# Altium schematic sheet supply0.SchDoc: foxBMS BMS-Master
size A3; DocumentNumber: 2; SheetNumber: 2; SheetTotal: 24; Author: Fraunhofer IISB foxBMS Team; REL-DATE: 2017-05-16; VERSION: 1.0.2; SheetDescription: Supply for MCU0 and peripherals
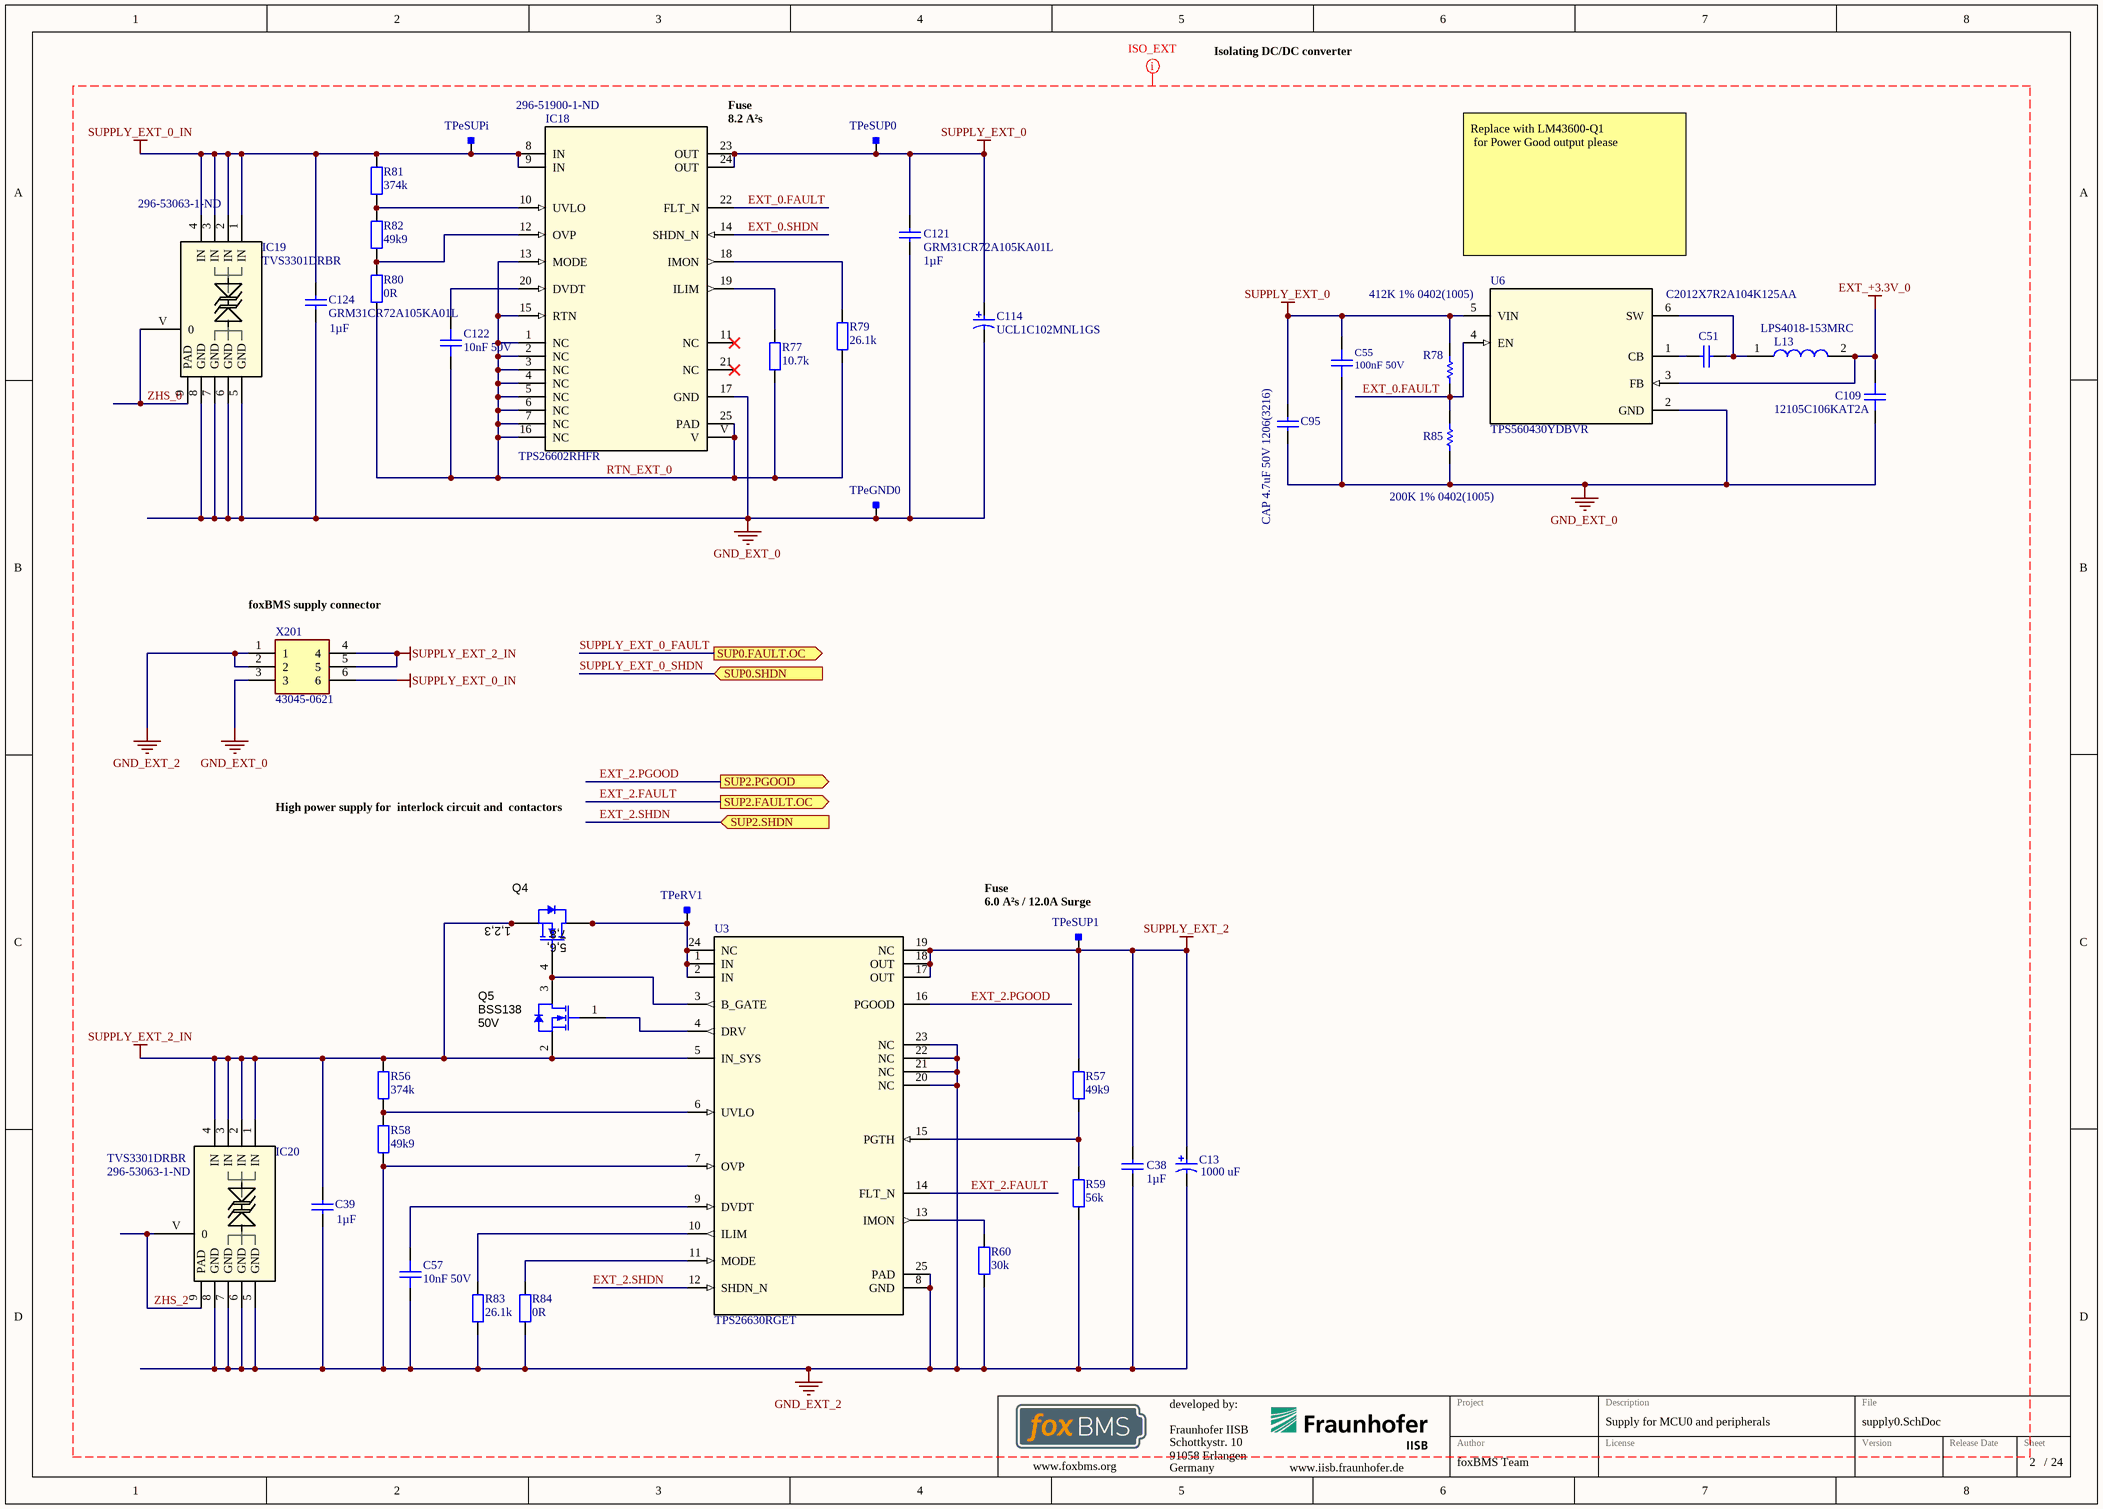
[diagram p0: supply0.SchDoc]

## Parts
C13  Rated Capacitance: 1000 uF  [NIC-UCL-10x13.5-2_V]  (hidden comment: UCL1C102MNL1GS)
C38  Capacitance: 1µF  [CAPC3216X180X55ML20T25]  (hidden comment: GRM31CR72A105KA01L)
C39  Capacitance: 1µF  [CAPC3216X180X55ML20T25]  (hidden comment: GRM31CR72A105KA01L)
C51  C2012X7R2A104K125AA  [CAPC2013X145X20ML20]
C55  100nF 50V  [0603C]
C57  10nF 50V  [0402C]
C95  CAP 4.7uF 50V 1206(3216)  [CAPC1206(3216)190_N]
C109  12105C106KAT2A  [CAPC3225X279X50LL20T25]
C114  UCL1C102MNL1GS  [NIC-UCL-10x13.5-2_V]
C121  GRM31CR72A105KA01L  Capacitance: 1µF  [CAPC3216X180X55ML20T25]
C122  10nF 50V  [0402C]
C124  GRM31CR72A105KA01L  Capacitance: 1µF  [CAPC3216X180X55ML20T25]
IC18  TPS26602RHFR  Supplier Part Number 1: 296-51900-1-ND  [RHF0024A]
IC19  TVS3301DRBR  Supplier Part Number 1: 296-53063-1-ND  [DRB0008F]
IC20  TVS3301DRBR  Supplier Part Number 1: 296-53063-1-ND  [DRB0008F]
L13  LPS4018-153MRC  [LPS4018223MRC]
Q4  CSD17308Q3  [TRANS_NexFET_Q3]  (value not drawn)
Q5  BSS138  value 50V  [SOT-23]
R56  374k  [0402R]
R57  49k9  [0402R]
R58  49k9  [0402R]
R59  56k  [0402R]
R60  30k  [0402R]
R77  10.7k  [0402R]
R78  412K 1% 0402(1005)  [RESC0402(1005)_L]
R79  26.1k  [0402R]
R80  0R  [0402R]
R81  374k  [0402R]
R82  49k9  [0402R]
R83  26.1k  [0402R]
R84  0R  [0402R]
R85  200K 1% 0402(1005)  [RESC0402(1005)_L]
TPeGND0  Testpoint_Square  [Testpoint_S1]  (value not drawn)  (no BOM)
TPeRV1  Testpoint_Square  [Testpoint_S1]  (value not drawn)  (no BOM)
TPeSUP0  Testpoint_Square  [Testpoint_S1]  (value not drawn)  (no BOM)
TPeSUP1  Testpoint_Square  [Testpoint_S1]  (value not drawn)  (no BOM)
TPeSUPi  Testpoint_Square  [Testpoint_S1]  (value not drawn)  (no BOM)
U3  TPS26630RGET  [RGE0024H]
U6  TPS560430YDBVR  [DBV0006A_N]
X201  43045-0621  [43045-0621]

## Ports
SUP0.FAULT.OC (out), SUP0.SHDN (in), SUP2.FAULT.OC (out), SUP2.PGOOD (out), SUP2.SHDN (in)

## Nets
EXT_+3.3V_0: C109.2 L13.2 U6.3(FB)
GND_EXT_0: C55.1 C95.1 C109.1 C114.2 C121.1 C124.1 IC18.17(GND) IC19.5(GND) IC19.6(GND) IC19.7(GND) IC19.8(GND) R85.1 TPeGND0.1 U6.2(GND) X201.3
GND_EXT_2: C13.2 C38.1 C39.1 C57.2 IC20.5(GND) IC20.6(GND) IC20.7(GND) IC20.8(GND) R58.1 R59.1 R60.1 R83.1 R84.1 U3.7(OVP) U3.8(GND) U3.20(NC) U3.21(NC) U3.22(NC) U3.23(NC) U3.25(PAD) X201.1 X201.2
SUPPLY_EXT_0: C55.2 C95.2 C114.1 C121.2 IC18.23(OUT) IC18.24(OUT) R78.2 TPeSUP0.1 U6.5(VIN)
SUPPLY_EXT_0_IN: C124.2 IC18.8(IN) IC18.9(IN) IC19.1(IN) IC19.2(IN) IC19.3(IN) IC19.4(IN) R81.2 TPeSUPi.1 X201.6
SUPPLY_EXT_2: C13.1 C38.2 R57.2 TPeSUP1.1 U3.17(OUT) U3.18(OUT) U3.19(NC)
SUPPLY_EXT_2_IN: C39.2 IC20.1(IN) IC20.2(IN) IC20.3(IN) IC20.4(IN) Q4.1(S) Q4.2(S) Q4.3(S) Q5.2(S) R56.2 U3.5(IN_SYS) X201.4 X201.5
EXT_0.FAULT: IC18.22(FLT_N) R78.1 R85.2 U6.4(EN)
EXT_0.SHDN: IC18.14(SHDN_N)
EXT_2.FAULT: U3.14(FLT_N) ; port SUP2.FAULT.OC
EXT_2.PGOOD: U3.16(PGOOD) ; port SUP2.PGOOD
EXT_2.SHDN: U3.12(SHDN_N) ; port SUP2.SHDN
RTN_EXT_0: C122.2 IC18.1(NC) IC18.2(NC) IC18.3(NC) IC18.4(NC) IC18.5(NC) IC18.6(NC) IC18.7(NC) IC18.13(MODE) IC18.15(RTN) IC18.16(NC) IC18.25(PAD) IC18.V R77.1 R79.1 R80.1
SUPPLY_EXT_0_FAULT: port SUP0.FAULT.OC
SUPPLY_EXT_0_SHDN: port SUP0.SHDN
ZHS_0: IC19.9(PAD) IC19.V(0)
ZHS_2: IC20.9(PAD) IC20.V(0)
NetC51_1: C51.1 U6.1(CB)
NetC51_2: C51.2 L13.1 U6.6(SW)
NetC57_1: C57.1 U3.9(DVDT)
NetC122_1: C122.1 IC18.20(DVDT)
NetIC18_10: IC18.10(UVLO) R81.1 R82.2
NetIC18_12: IC18.12(OVP) R80.2 R82.1
NetIC18_18: IC18.18(IMON) R79.2
NetIC18_19: IC18.19(ILIM) R77.2
NetQ4_4: Q4.4(G) Q5.3(D) U3.3(B_GATE)
NetQ4_5: Q4.5(D) Q4.6(D) Q4.7(D) Q4.8(D) TPeRV1.1 U3.1(IN) U3.2(IN) U3.24(NC)
NetQ5_1: Q5.1(G) U3.4(DRV)
NetR56_1: R56.1 R58.2 U3.6(UVLO)
NetR57_1: R57.1 R59.2 U3.15(PGTH)
NetR60_2: R60.2 U3.13(IMON)
NetR83_2: R83.2 U3.10(ILIM)
NetR84_2: R84.2 U3.11(MODE)

Not connected (* = marked no-connect by the designer): IC18 11(NC)* 21(NC)*

## Layout directives
net class ISO_EXT: EXT_0.FAULT, EXT_0.SHDN, EXT_2.FAULT, EXT_2.PGOOD, EXT_2.SHDN, EXT_+3.3V_0, GND_EXT_0, GND_EXT_2, RTN_EXT_0, SUPPLY_EXT_0, SUPPLY_EXT_0_FAULT, SUPPLY_EXT_0_IN, SUPPLY_EXT_0_SHDN, SUPPLY_EXT_2, SUPPLY_EXT_2_IN, ZHS_0, ZHS_2

## Notes on the sheet
- (near IC18) Fuse
- Isolating DC/DC converter
- (near IC18) 8.2 A²s
- Replace with LM43600-Q1
  for Power Good output please
- (near X201) foxBMS supply connector
- High power supply for
  interlock circuit and
  contactors
- Fuse
- (near TPeSUP1) 6.0 A²s / 12.0A Surge
- Fraunhofer IISB
- Schottkystr. 10
- developed by:
- 91058 Erlangen
- Germany
- Author
- Project
- License
- Description
- File
- Version
- Release Date
- Sheet
- www.foxbms.org
- www.iisb.fraunhofer.de
- foxBMS Team
- /
- (in symbol CSD17308Q3) 1,2,3; 7,8; 5,6,

## Library data of the parts
C13 = CMP-0926-00001-1: Aluminum Electrolytic Capacitor, Low Impedance, 1000 uF +/- 20%, 16 V, -55 to 105 degC, 2-Pin 10.3 x 10.3 x 13.5 mm SMD, RoHS, Reel; Manufacturer: Nichicon; Rated Voltage: 16 V; Capacitance Tolerance: +/- 20%; Polarity Type: Polar; Impedance: 0.06 ohm; Leakage Current: 160 uA; Rated Ripple Current (at 100 kHz): 1190 mA; Capacitance: 1000uF; PackageReference: UCL-10x13.5-2; Mounting Technology: Surface Mount; PackageDescription: 2-Pin SMD, Body 10.3 x 10.3 mm, Height 14.3 mm; ComponentLink1Description: Manufacturer URL; ComponentLink2Description: Datasheet; RoHS: TRUE; DatasheetVersion: Sep-13; PartNumber: UCL1C102MNL1GS; ComponentLink2URL: http://nichicon-us.com/english/products/pdfs/e-cl.pdf; ComponentLink1URL: www.nichicon.com; Packing: Reel; Category Temperature Range: -55 to 105 degC; Part Number: UCL1C102MNL1GS
C38 C39 C121 C124 = gen_C_ceramic_1u_100V_X7R_1206: Chip Capacitor, 1 uF, +/- 10%, 100 V, -55 to 125 degC, 1206 (3216 Metric), RoHS, Tape and Reel; Manufacturer: Murata; Catalog Drawings: GRMSeries_1206_1.6; Featured Product: GA3SafetyRecognizedCapsandHi-CapMLCC; Online Catalog: GRMSeries; Temperature Coefficient: X7R; Product Training Modules: High-CapMultilayerCeramicCapacitors; Other Names: 490-3909-6; Voltage - Rated: 100V; Case EIA: 1206; PnP Package: C_1206_10; PnP Value: 1.0µF/100V/X7R; Height - Seated (Max): -; Features: -; Applications: GeneralPurpose; Manufacturer URL: http://www.murata.com/; Standard Package: 1; Package Reference: 1206; Series: GRM; Package / Case: 1206(3216Metric); Datasheet Version: Sep-11; Ratings: -; Category: Capacitors; Datasheet URL: https://datasheet.ciiva.com/29199/454987-da-01-en-vs-kondensator-1206-29199435.pdf; Operating Temperature: -55degC~125degC; Lead Spacing: -; Family: CeramicCapacitors; Tolerance: ±10%; Packaging: Digi-Reel; Mounting Type: SurfaceMount,MLCC; Package Description: 2-Pin Surface Mount Device, Body 3.2 x 1.6 mm; Lead Style: -; Thickness (Max): 0.071"(1.80mm); Size / Dimension: 0.126"Lx0.063"W(3.20mmx1.60mm); Dielectric: X7R; Rated Voltage: 100V
C51 = CMP-2000-05453-1: Chip Capacitor, 100 nF, +/- 10%, 100 V, -55 to 1255 degC, 0805 (2012 Metric), RoHS, Tape and Reel; Manufacturer: TDK; PCN Part Number: MLCCPartNumberChange30/Nov/2012; Temperature Coefficient: X7R; Voltage - Rated: 100V; Kits: SAMPLEKIT1008-ND-KITCAPCERMLCC100V-630V; Other Names: 445-1418-1; Online Catalog: CSeries,MidVoltage; Featured Product: C-SeriesMidVoltageMLCCs; Catalog Drawings: CSERIES_2012-0805_1.45; Product Training Modules: HighCapacitanceReplacementSEAT,CCV,andTVCLDesignToolsGuidetoReplacinganElectrolyticCapacitorwithanMLCC; Capacitance: 0.1µF; Applications: GeneralPurpose; Datasheet Version: Jul-13; Mounting Type: SurfaceMount,MLCC; Height - Seated (Max): -; Packaging: CutTape(CT); Datasheet URL: https://datasheet.ciiva.com/11788/0900766b80fc5cba-11788142.pdf; Tolerance: ±10%; Package Reference: 805; Manufacturer URL: http://www.tdk.com/; Series: C; Lead Style: -; Operating Temperature: -55degC~125degC; Category: Capacitors; Package Description: 2-Pin Surface Mount Device, Body 2 x 1.25 mm; Standard Package: 1; Package / Case: 0805(2012Metric); Family: CeramicCapacitors; RoHS Information: RoHSCertificate-MLCC; Lead Spacing: -; Ratings: -; Features: -
C55 = gen_C_ceramic_100n_50V_X7R_0603: Ceramic, 100nF, ±10%, 50V, X7R, –55 to 125°C, 0603 (1608),RoHS, Automotive; Part Number: GCJ188R71H104KA12; Manufacturer: Murata; Capacitance: 100n; Case EIA: 0603; Case Metric: 1608; Automotive Qualified: True; PnP Package: C_0603_10; PnP Value: 100nF/50V/X7R; Dielectric: X7R; Rated Voltage: 50V; Height - Seated (Max): 0.8mm; Mounting Type: SurfaceMount,MLCC; Operating Temperature: –55 to 125°C; Series: GCJ; Tolerance: ±10%; Manufacturer_Part_Number: GCJ188R71H104KA12; Supplier 1: Digi-Key; Supplier Part Number 1: 490-5798-1-ND
C57 C122 = gen_C_ceramic_10n_50V_X7R_0402: Ceramic, 10nF, ±10%, 50V, X7R, –55 to 125°C, 0402 (1005),RoHS, Automotive; Part Number: GRT155R71H104KE01; Automotive Qualified: True; Capacitance: 10n; Case EIA: 0402; Case Metric: 1005; PnP Package: C_0402_10; PnP Value: 10n/50V/X7R; Dielectric: X7R; Rated Voltage: 50V
C95 = CMP-1037-04923-1: CAP 4.7uF 50V ±10% 1206 (3216 Metric) Thickness 1.9mm SMD; Case-EIA: 1206; Case-Metric: 3216; Tolerance: Â±10%; Technology: SMT; Rated Voltage: 50 V; Max Thickness: 1.9 mm; Value: 4.7uF
C109 = gen_C_ceramic_10u_50V_X7R_1210: Ceramic, 10uF, 50 V, -55 to 125 degC, 2-Pin SMD (1210), RoHS, Tape and Reel; Manufacturer: AVX; Manufacturer 1: Kyocera AVX; Dielectric: X7R; Tolerance: ±10%; Load Life: 1000h; Type: CommercialSurfaceMountChip; Voltage Rating: 50V; Temperature Coefficient / Code: +/-15%; Case EIA: 1210; Case Metric: 3225; PnP Package: C_1210_10; PnP Value: 10µF/25V/X7R; Rated Voltage: 25V; Maximum Operating Temperature: +125C; Mounting Technology: SurfaceMount; Case Code - in: 1210; Package Description: 2-Pin Surface Mount Device, Body 3.2 x 2.5 mm; Datasheet URL: http://www.farnell.com/datasheets/1818074.pdf; Case Code - mm: 3225; Package / Case: 1210(3225metric); Product: GeneralTypeMLCCs; Capacitance: 10uF; Product Category: MultilayerCeramicCapacitorsMLCC-SMD/SMT; Minimum Operating Temperature: -55C; Manufacturer URL: http://www.avx.com/; Operating Temperature Range: -55Cto+125C; Termination Style: SMD/SMT; Factory Pack Quantity: 1000; RoHS: Details; Brand: AVX; Datasheet Version: 03/2014; Package Reference: 1210; Packaging: Reel; Voltage Rating DC: 50V; Height - Seated (Max): 2.5mm; Mounting Type: SurfaceMount,MLCC; Operating Temperature: –55 to 125°C; Series: GCM; Manufacturer Part Number 1: 12105C106KAT2A
C114 = CMP-0926-00001-1: Aluminum Electrolytic Capacitor, Low Impedance, 1000 uF +/- 20%, 16 V, -55 to 105 degC, 2-Pin 10.3 x 10.3 x 13.5 mm SMD, RoHS, Reel; Manufacturer: Nichicon; Rated Voltage: 16 V; Capacitance Tolerance: +/- 20%; Rated Capacitance: 1000 uF; Polarity Type: Polar; Impedance: 0.06 ohm; Leakage Current: 160 uA; Rated Ripple Current (at 100 kHz): 1190 mA; Capacitance: 1000uF; PackageReference: UCL-10x13.5-2; Mounting Technology: Surface Mount; PackageDescription: 2-Pin SMD, Body 10.3 x 10.3 mm, Height 14.3 mm; ComponentLink1Description: Manufacturer URL; ComponentLink2Description: Datasheet; RoHS: TRUE; DatasheetVersion: Sep-13; PartNumber: UCL1C102MNL1GS; ComponentLink2URL: http://nichicon-us.com/english/products/pdfs/e-cl.pdf; ComponentLink1URL: www.nichicon.com; Packing: Reel; Category Temperature Range: -55 to 105 degC; Part Number: UCL1C102MNL1GS
IC18 = TPS26602RHFR: 37V Clamped input protection; Manufacturer: Texas Instruments; PartNumber: TPS26602RHFR; RefDes: RefDes; TYPE: TYPE; Value: Value; Part Number: TPS26602RHFR; Supplier 1: Digi-Key
IC19 IC20 = TVS3301DRVR: TVS3301 33-V Bidirectional Flat-Clamp Surge Protection Device; Manufacturer: Texas Instruments; Part Number: TVS3301DRBR; RefDes: RefDes; TYPE: TYPE; Value: Value; Supplier 1: Digi-Key
L13 = LPS4018-223MRC: Inductor 15uH; Manufacturer_Name: COILCRAFT; Datasheet Link: https://www.coilcraft.com/pdfs/lps4018.pdf; Height: 1.8mm; Manufacturer_Part_Number: LPS4018-223MRC; Mouser Part Number: 994-LPS4018-223MRC; Mouser Price/Stock: https://www.mouser.com/Search/Refine.aspx?Keyword=994-LPS4018-223MRC
Q4 = CSD17308Q3: MOSFET, N-CH, 30V, 47A, SON 3.3x3.3mm; Manufacturer: Texas Instruments; Alternate Manufacturer: None; U/M: EA; ChType: N; VdsMax_V: 30; Value1: 0.0094 ohm; Rdson45_Ohm: 0.0094; Value2: 3.9 nC; QgTyp_nC: 3.9; Vgs_V: 10; IdsMax_A: 47; SymbolVersion: 2008-07-09; CompType: MOSFET; Value: 30V; PartNumber: CSD17308Q3; PackageReference: SON 3.3x3.3mm; RoHS: Y; MountType: SMT; Published: 2008-06-19; Publisher: Texas Instruments; LatestRevisionDate: 2013-07-24; LatestRevisionNote: Added parts.; ComponentLink1Description: Datasheet link; ComponentLink1URL: http://www.ti.com/lit/ds/symlink/csd17308q3.pdf; Supplier 1: Digi-Key; Supplier Part Number 1: 296-27210-1-ND; Supplier 2: Mouser; Supplier Part Number 2: 595-CSD17308Q3; Supplier 3: Farnell; Supplier Part Number 3: 1892457
Q5 = BSS138: MOSFET, N-CH, 50V, 0.22A, SOT-23; Manufacturer: Fairchild Semiconductor; Alternate Manufacturer: None; U/M: EA; ChType: N; VdsMax_V: 50; Value1: 6 ohm; Rdson45_Ohm: 6; Value2: 1.7 nC; QgTyp_nC: 1.7; Vgs_V: 20; IdsMax_A: 0.22; ComponentLink1URL: http://www.fairchildsemi.com/ds/BS/BSS138.pdf; SymbolVersion: 2008-07-28; PackageReference: SOT-23; PartNumber: BSS138; ComponentLink1Description: Datasheet link; CompType: MOSFET; RoHS: Y; MountType: SMT; Published: 2008-06-19; Publisher: Texas Instruments; LatestRevisionDate: 2013-07-10; LatestRevisionNote: Added parts.; Supplier 1: Digi-Key; Supplier Part Number 1: BSS138CT-ND; Supplier 2: Mouser; Supplier Part Number 2: 512-BSS138; Supplier 3: Farnell; Supplier Part Number 3: 9845330
R56 R81 = gen_R_374k_0402: SMD Resistor 374k 0402; Case EIA: 0402; Case Metric: 1005; PnP Package: R_0402; Automotive Qualified: False; PnP Value: 374k; Operating Temperature: -55°C - +155°C; Part Number: gen_R_374k_0402
R57 R58 R82 = gen_R_49k9_0402: SMD Resistor 49.9k 0402; Case EIA: 0402; Case Metric: 1005; PnP Package: R_0402; Automotive Qualified: False; PnP Value: 49k9; Operating Temperature: -55°C - +155°C; Part Number: gen_R_49k9_0402
R59 = gen_R_49k9_0402: SMD Resistor 49.9k 0402; Case EIA: 0402; Case Metric: 1005; PnP Package: R_0402; PnP Value: 49k9; Automotive Qualified: False; Operating Temperature: -55°C - +155°C; Part Number: gen_R_49k9_0402
R60 = gen_R_10K7_0402: SMD Resistor 30k 0402; Part Number: gen_R_10.7k_0402; Case EIA: 0402; Case Metric: 1005; PnP Package: R_0402; PnP Value: 10.7k; Automotive Qualified: False; Operating Temperature: -55°C - +155°C
R77 = gen_R_10K7_0402: SMD Resistor 10.7k 0402; Part Number: gen_R_10.7k_0402; Case EIA: 0402; Case Metric: 1005; PnP Package: R_0402; Automotive Qualified: False; PnP Value: 10.7k; Operating Temperature: -55°C - +155°C
R78 = CMP-1011-00805-1: 412K 0.063W 1% 0402 (1005 Metric)  SMD; Case-EIA: 0402; Case-Metric: 1005; Value: 412000.00 Ohm; Tolerance: 1 %; Technology: SMT; Power: 0.063 W
R79 R83 = gen_R_26k1_0402: SMD Resistor 26.1k 0402; Part Number: gen_R_26.1k_0402; Case EIA: 0402; Case Metric: 1005; PnP Package: R_0402; Automotive Qualified: False; PnP Value: 26.1k; Operating Temperature: -55°C - +155°C
R80 R84 = gen_R_0R_0402: SMD Resistor 0R 0402; Case EIA: 0402; Case Metric: 1005; PnP Package: R_0402; Automotive Qualified: False; PnP Value: 0R; Part Number: gen_R_0R_0402; Operating Temperature: -55°C - +155°C
R85 = CMP-1011-00768-1: 200K 0.063W 1% 0402 (1005 Metric)  SMD; Value: 200000.00 Ohm; Case-Metric: 1005; Case-EIA: 0402; Tolerance: 1 %; Power: 0.063 W; Technology: SMT
TPeGND0 TPeRV1 TPeSUP0 TPeSUP1 TPeSUPi = Testpoint_Square: Testpoint, square; Part Number: Testpoint_Square
U3 = TPS26630RGET: Imported; Manufacturer: Texas Instruments; PartNumber: TPS26630RGER; RefDes: RefDes; TYPE: TYPE; Value: Value
U6 = TPS560430YDBVR: Imported; Manufacturer: Texas Instruments; PartNumber: TPS560430YDBVR; RefDes: RefDes; TYPE: TYPE; Value: Value
X201 = 43045-0621: Micro-Fit 3.0 Right Angle Header, 3.00mm Pitch, Dual Row, 6 Circuits, with Snap-in Plastic Peg PCB Lock, Tin, Glow Wire Capable, Black, 43045-0621; Manufacturer_Name: Molex; Part Name: MicroFit; Circuits: 6; Datasheet Link: http://www.molex.com/webdocs/datasheets/pdf/en-us//0430450621_PCB_HEADERS.pdf; Height: 8mm; Manufacturer_Part_Number: 43045-0621; Mouser Part Number: 538-43045-0621; Mouser Price/Stock: https://www.mouser.com/Search/Refine.aspx?Keyword=538-43045-0621; RS Part Number: 6700380; RS Price/Stock: https://uk.rs-online.com/web/p/products/6700380